# EAGLE schematic F2L (EAGLE 5.11)
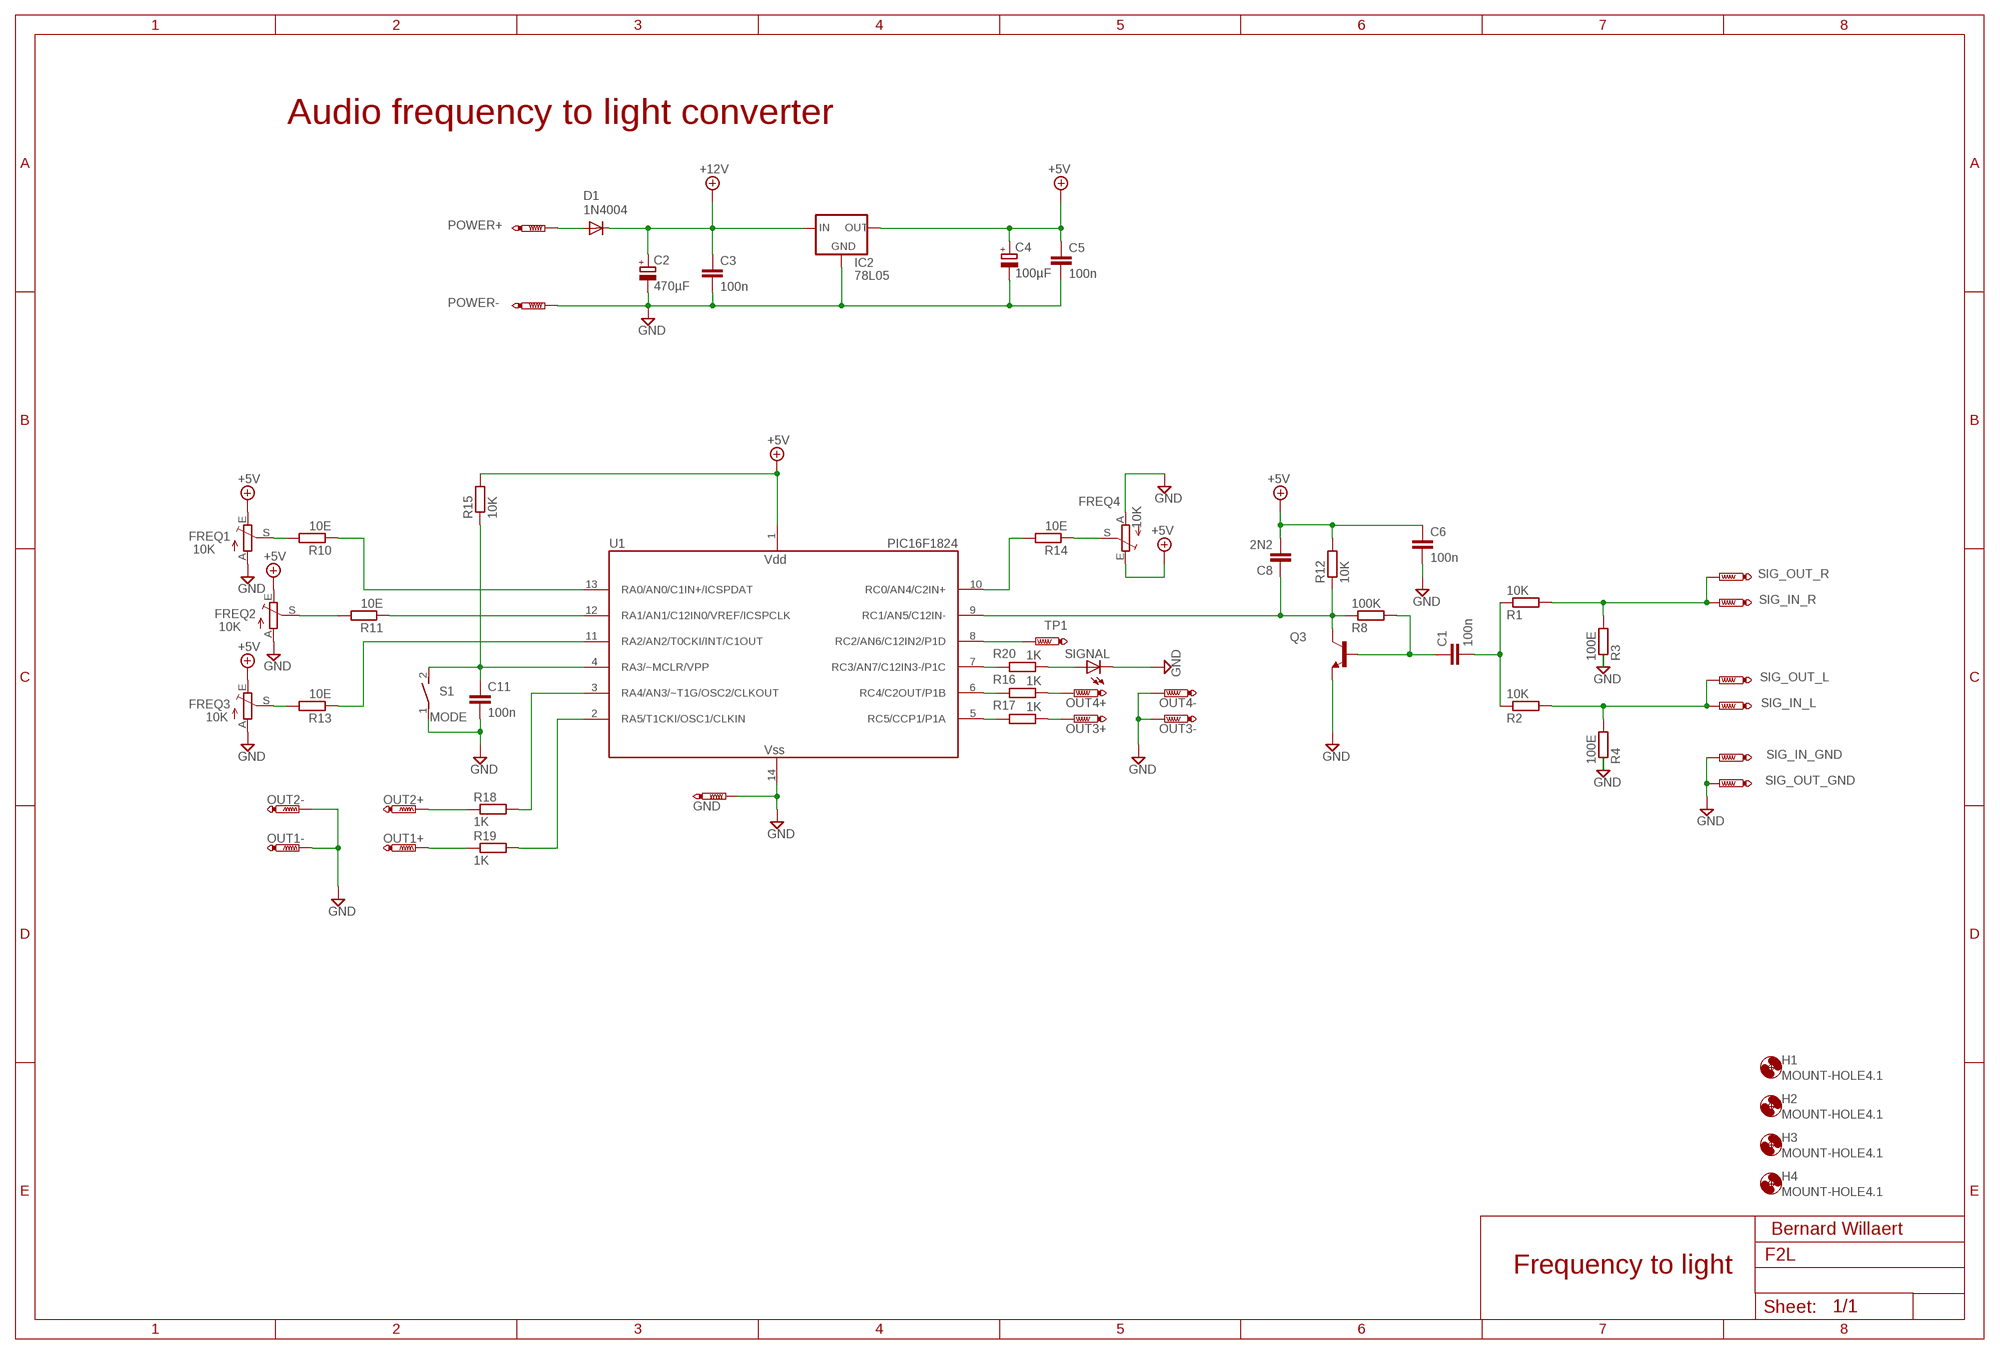
[diagram p0: schematic, sheet 1]

## Parts
C1  100n  C-EU050-025X075  [C050-025X075]
C2  470µF  CPOL-EUE5-6  [E5-6]
C3  100n  C-EU050-025X075  [C050-025X075]
C4  100µF  CPOL-EUE5-6  [E5-6]
C5  100n  C-EU050-025X075  [C050-025X075]
C6  100n  C-EU050-025X075  [C050-025X075]
C8  2N2  C-EU050-025X075  [C050-025X075]
C11  100n  C-EU050-025X075  [C050-025X075]
D1  1N4004  [DO41-10]
FREQ1  10K  TRIM_EU-RJ9W  [RJ9W]
FREQ2  10K  TRIM_EU-RJ9W  [RJ9W]
FREQ3  10K  TRIM_EU-RJ9W  [RJ9W]
FREQ4  10K  TRIM_EU-RJ9W  [RJ9W]
GND  PTR1PAD1-17  [P1-17]
H1  MOUNT-HOLE4.1  [4,1]
H2  MOUNT-HOLE4.1  [4,1]
H3  MOUNT-HOLE4.1  [4,1]
H4  MOUNT-HOLE4.1  [4,1]
IC2  78L05  78LXX  [78LXX]
OUT1+  PTR1PAD1-17  [P1-17]
OUT1-  PTR1PAD1-17  [P1-17]
OUT2+  PTR1PAD1-17  [P1-17]
OUT2-  PTR1PAD1-17  [P1-17]
OUT3+  PTR1PAD1-17  [P1-17]
OUT3-  PTR1PAD1-17  [P1-17]
OUT4+  PTR1PAD1-17  [P1-17]
OUT4-  PTR1PAD1-17  [P1-17]
POWER+  POWER +  PTR1PAD1-17  [P1-17]
POWER-  PTR1PAD1-17  [P1-17]
Q3  BC549B  [TO92-EBC]
R1  10K  R-EU_0207/10  [0207/10]
R2  10K  R-EU_0207/10  [0207/10]
R3  100E  R-EU_0207/10  [0207/10]
R4  100E  R-EU_0207/10  [0207/10]
R8  100K  R-EU_0207/10  [0207/10]
R10  10E  R-EU_0207/10  [0207/10]
R11  10E  R-EU_0207/10  [0207/10]
R12  10K  R-EU_0207/10  [0207/10]
R13  10E  R-EU_0207/10  [0207/10]
R14  10E  R-EU_0207/10  [0207/10]
R15  10K  R-EU_0207/10  [0207/10]
R16  1K  R-EU_0207/10  [0207/10]
R17  1K  R-EU_0207/10  [0207/10]
R18  1K  R-EU_0207/10  [0207/10]
R19  1K  R-EU_0207/10  [0207/10]
R20  1K  R-EU_0207/10  [0207/10]
S1  MODE  DS01E  [DS-01]
SIG_IN_GND  PTR1PAD1-17  [P1-17]
SIG_IN_L  PTR1PAD1-17  [P1-17]
SIG_IN_R  PTR1PAD1-17  [P1-17]
SIG_OUT_GND  PTR1PAD1-17  [P1-17]
SIG_OUT_L  PTR1PAD1-17  [P1-17]
SIG_OUT_R  PTR1PAD1-17  [P1-17]
SIGNAL  LED3MM  [LED3MM]
TP1  PTR1PAD1-17  [P1-17]
U1  PIC16F1824  PIC16616P  [DIP-14]

## Nets
+5V: C4.+ C5.1 FREQ1.E FREQ2.E FREQ3.E IC2.OUT R15.2 U1.1(VDD)
+12V: C2.+ C3.1 D1.C FREQ4.E IC2.IN ; supply symbol labelled +5V
GND: C2.- C3.2 C4.- C5.2 C6.2 C11.2 FREQ1.A FREQ2.A FREQ3.A FREQ4.A GND.TP IC2.GND OUT1-.TP OUT2-.TP OUT3-.TP OUT4-.TP POWER-.TP Q3.E R3.1 R4.1 S1.1 SIG_IN_GND.TP SIG_OUT_GND.TP SIGNAL.K(C) U1.14(VSS)
N$1: R2.2 R4.2 SIG_IN_L.TP SIG_OUT_L.TP
N$2: R1.2 R3.2 SIG_IN_R.TP SIG_OUT_R.TP
N$3: C1.2 R1.1 R2.1
N$4: FREQ1.S R10.2
N$5: R10.1 U1.13(RA0/AN0/C1IN+/ICSPDAT)
N$6: FREQ2.S R11.2
N$7: R14.2 U1.10(RC0/AN4/C2IN+)
N$8: R11.1 U1.12(RA1/AN1/C12IN0/VREF/ICSPCLK)
N$9: FREQ3.S R13.2
N$10: C11.1 R15.1 S1.2 U1.4(RA3/~MCLR/VPP)
N$11: R13.1 U1.11(RA2/AN2/T0CKI/INT/C1OUT)
N$12: R16.2 U1.6(RC4/C2OUT/P1B)
N$13: OUT4+.TP R16.1
N$14: C8.1 Q3.C R8.1 R12.1 U1.9(RC1/AN5/C12IN-)
N$15: FREQ4.S R14.1
N$16: R17.2 U1.5(RC5/CCP1/P1A)
N$17: C1.1 Q3.B R8.2
N$18: OUT3+.TP R17.1
N$19: R18.2 U1.3(RA4/AN3/~T1G/OSC2/CLKOUT)
N$20: OUT2+.TP R18.1
N$21: OUT1+.TP R19.1
N$22: R19.2 U1.2(RA5/T1CKI/OSC1/CLKIN)
N$23: C6.1 C8.2 R12.2 ; supply symbol labelled +5V
N$24: R20.2 U1.7(RC3/AN7/C12IN3-/P1C)
N$25: R20.1 SIGNAL.A
N$26: TP1.TP U1.8(RC2/AN6/C12IN2/P1D)
N$28: D1.A POWER+.TP

## Notes on the sheet
- Audio frequency to light converter
- Bernard Willaert
- Frequency to light

## Library data of the parts
C1 C3 C5 C6 C8 C11 = rcl:C-EU: CAPACITOR, European symbol
C2 C4 = rcl:CPOL-EU: POLARIZED CAPACITOR, European symbol
D1 = diode:1N4004: DIODE general purpose rectifier, 1 A
FREQ1-FREQ4 = pot:TRIM_EU-: POTENTIOMETER
GND OUT1+ OUT1- OUT2+ OUT2- OUT3+ OUT3- OUT4+ OUT4- POWER+ POWER- SIG_IN_GND SIG_IN_L SIG_IN_R SIG_OUT_GND SIG_OUT_L SIG_OUT_R TP1 = testpad:PTR1: TEST PIN
H1-H4 = holes:MOUNT-HOLE: MOUNTING HOLE with drill center marker
IC2 = v-reg:78LXX: VOLTAGE REGULATOR
Q3 = transistor-npn:BC549*: NPN Transistor
R1-R4 R8 R10-R20 = rcl:R-EU_: RESISTOR, European symbol
S1 = switch-dil:DS01E: DIL/CODE SWITCH; OC_FARNELL: unknown; OC_NEWARK: unknown
SIGNAL = led:LED: LED OSRAM: - CHIPLED LG R971, LG N971, LY N971, LG Q971, LY Q971, LO R971, LY R971 LH N974, LH R974 LS Q976, LO Q976, LY Q976 LO Q996 - Hyper CHIPLED LW Q18S LB Q993, LB Q99A, LB R99A - SideLED LS A670, LO A670, LY A670, LG A670, LP A670 LB A673, LV A673, LT A673, LW A673 LH A674 LY A675 LS A676, LA A676, LO A676, LY A676, LW A676 LS A679, LY A679, LG A679 - Hyper Micro SIDELED® LS Y876, LA Y876, LO Y876, LY Y876 LT Y87S - SmartLED LW L88C, LW L88S LB L89C, LB L89S, LG L890 LS L89K, LO L89K, LY L89K LS L896, LA L896, LO L896, LY L896 - TOPLED LS T670, LO T670, LY T670, LG T670, LP T670 LSG T670, LSP T670, LSY T670, LOP T670, LYG T670 LG T671, LOG T671, LSG T671 LB T673, LV T673, LT T673, LW T673 LH T674 LS T676, LA T676, LO T676, LY T676, LB T676, LH T676, LSB T676, LW T676 LB T67C, LV T67C, LT T67C, LS T67K, LO T67K, LY T67K, LW E67C LS E67B, LA E67B, LO E67B, LY E67B, LB E67C, LV E67C, LT E67C LW T67C LS T679, LY T679, LG T679 LS T770, LO T770, LY T770, LG T770, LP T770 LB T773, LV T773, LT T773, LW T773 LH T774 LS E675, LA E675, LY E675, LS T675 LS T776, LA T776, LO T776, LY T776, LB T776 LHGB T686 LT T68C, LB T68C - Hyper Mini TOPLED® LB M676 - Mini TOPLED Santana® LG M470 LS M47K, LO M47K, LY M47K Source: http://www.osram.convergy.de LUXEON: - LUMILED® LXK2-PW12-R00, LXK2-PW12-S00, LXK2-PW14-U00, LXK2-PW14-V00 LXK2-PM12-R00, LXK2-PM12-S00, LXK2-PM14-U00 LXK2-PE12-Q00, LXK2-PE12-R00, LXK2-PE12-S00, LXK2-PE14-T00, LXK2-PE14-U00 LXK2-PB12-K00, LXK2-PB12-L00, LXK2-PB12-M00, LXK2-PB14-N00, LXK2-PB14-P00, LXK2-PB14-Q00 LXK2-PR12-L00, LXK2-PR12-M00, LXK2-PR14-Q00, LXK2-PR14-R00 LXK2-PD12-Q00, LXK2-PD12-R00, LXK2-PD12-S00 LXK2-PH12-R00, LXK2-PH12-S00 LXK2-PL12-P00, LXK2-PL12-Q00, LXK2-PL12-R00 Source: www.luxeon.com KINGBRIGHT: KA-3528ASYC Source: www.kingbright.com
U1 = microchip2:PIC16*616: Microchip PIC16F616 and PIC16HV616 14-pin 8-bit Flash microcontroller 2048 words program memory, 128 bytes RAM 11 I/O, 8 10-bit A/D, 2 comparators, 2 8-bit timers, 1 16-bit timer High-voltage variant (HV) available